# EAGLE design uBus-V1.0 (EAGLE 7.3.0)
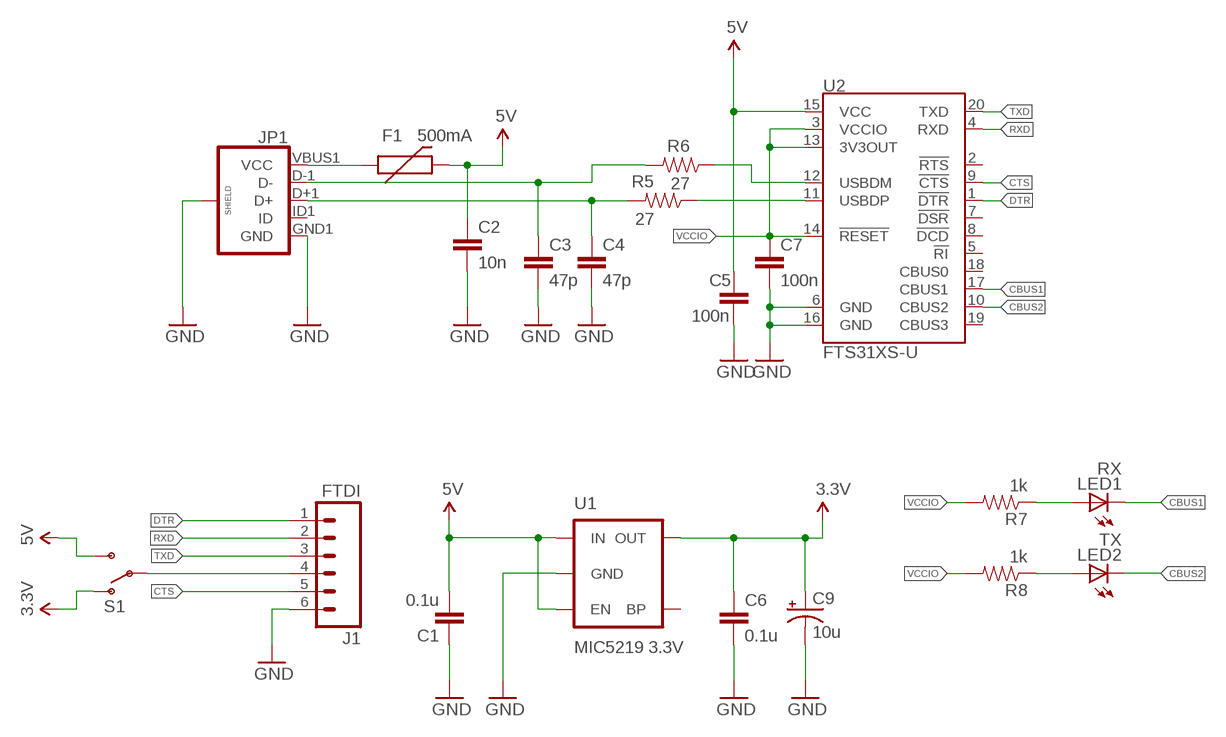
[diagram p0: schematic, sheet 1]

## Parts
C1  0.1u  CAP0603-CAP  [0603-CAP]
C2  10n  CAP0603-CAP  [0603-CAP]
C3  47p  CAP0603-CAP  [0603-CAP]
C4  47p  CAP0603-CAP  [0603-CAP]
C5  100n  CAP0603-CAP  [0603-CAP]
C6  0.1u  CAP0603-CAP  [0603-CAP]
C7  100n  CAP0603-CAP  [0603-CAP]
C9  10u  CPOL-USSMCP  [SMC_P]
F1  500mA  PTCSMD  [PTC-1206]
J1  FTDI  M06LONGPADS  [1X06_LONGPADS]
JP1  USB_MICROB_PLUGCONN-11752  [USB-B-MICRO-SMD_V03]
LED1  RX  LEDCHIP-LED0603  [CHIP-LED0603]
LED2  TX  LEDCHIP-LED0603  [CHIP-LED0603]
R5  27  RESISTOR0603-RES  [0603-RES]
R6  27  RESISTOR0603-RES  [0603-RES]
R7  1k  RESISTOR0603-RES  [0603-RES]
R8  1k  RESISTOR0603-RES  [0603-RES]
S1  SWITCH-SPDT-SMD-A  [SWITCH-SPST-SMD-A]
U1  MIC5219 3.3V  V_REG_MIC52193.3V  [SOT23-5]
U2  FTS31XS-U  FT231XS  [SSOP20_L]

## Nets
3.3V: C6.1 C9.+ S1.1(O) U1.5(OUT)
5V: C1.2 C2.1 C5.1 F1.2 S1.3(S) U1.1(IN) U1.3(EN) U2.15(VCC)
CBUS1: LED1.C U2.17(CBUS1)
CBUS2: LED2.C U2.10(CBUS2)
CTS: J1.5 U2.9(!CTS)
DTR: J1.1 U2.1(!DTR)
GND: C1.1 C2.2 C3.2 C4.2 C5.2 C6.2 C7.2 C9.- J1.6 JP1.GND1(GND) JP1.SHIELD1(SHIELD) JP1.SHIELD2(SHIELD) JP1.SHIELD3(SHIELD) U1.2(GND) U2.6(GND) U2.16(GND)
N$1: J1.4 S1.2(P)
N$3: LED2.A R8.1
N$4: LED1.A R7.1
N$7: R6.1 U2.12(USBDM)
N$8: R5.1 U2.11(USBDP)
N$9: C4.1 JP1.D+1(D+) R5.2
N$10: C3.1 JP1.D-1(D-) R6.2
N$11: F1.1 JP1.VBUS1(VCC)
RXD: J1.2 U2.4(RXD)
TXD: J1.3 U2.20(TXD)
VCCIO: C7.1 R7.2 R8.2 U2.3(VCCIO) U2.13(3V3OUT) U2.14(!RESET)
Unconnected: JP1.ID1(ID) U1.4(BP) U2.2(!RTS) U2.5(!RI) U2.7(!DSR) U2.8(!DCD) U2.18(CBUS0) U2.19(CBUS3)

## Library data of the parts
C1-C7 = SparkFun-Passives:CAP: Capacitor Standard 0603 ceramic capacitor, and 0.1" leaded capacitor.
C9 = rcl:CPOL-US: POLARIZED CAPACITOR, American symbol
F1 = SparkFun-PowerIC:PTC: Resettable Fuse PTC Resettable Fuse. Spark Fun Electronics SKU : COM-08357; PROD_ID: RES-11150
J1 = SparkFun-Connectors:M06: Header 6 Standard 6-pin 0.1" header. Use with straight break away headers (SKU : PRT-00116), right angle break away headers (PRT-00553), swiss pins (PRT-00743), machine pins (PRT-00117), and female headers (PRT-00115). Molex polarized connector foot print use with SKU : PRT-08094 with associated crimp pins and housings. NOTES ON THE VARIANTS LOCK and LOCK_LONGPADS... This footprint was designed to help hold the alignment of a through-hole component (i.e. 6-pin header) while soldering it into place. You may notice that each hole has been shifted either up or down by 0.005 of an inch from it's more standard position (which is a perfectly straight line). This slight alteration caused the pins (the squares in the middle) to touch the edges of the holes. Because they are alternating, it causes a "brace" to hold the component in place. 0.005 has proven to be the perfect amount of "off-center" position when using our standard breakaway headers. Although looks a little odd when you look at the bare footprint, once you have a header in there, the alteration is very hard to notice. Also,if you push a header all the way into place, it is covered up entirely on the bottom side. This idea of altering the position of holes to aid alignment will be further integrated into the Sparkfun Library for other footprints. It can help hold any component with 3 or more connection pins.
JP1 = SparkFun-Connectors:USB_MICROB_PLUG: USB Micro-B connectors Some male, some female. Watch your step!; PROD_ID: CONN-11752
LED1 LED2 = led:LED: LED OSRAM: - CHIPLED LG R971, LG N971, LY N971, LG Q971, LY Q971, LO R971, LY R971 LH N974, LH R974 LS Q976, LO Q976, LY Q976 LO Q996 - Hyper CHIPLED LW Q18S LB Q993, LB Q99A, LB R99A - SideLED LS A670, LO A670, LY A670, LG A670, LP A670 LB A673, LV A673, LT A673, LW A673 LH A674 LY A675 LS A676, LA A676, LO A676, LY A676, LW A676 LS A679, LY A679, LG A679 - Hyper Micro SIDELED® LS Y876, LA Y876, LO Y876, LY Y876 LT Y87S - SmartLED LW L88C, LW L88S LB L89C, LB L89S, LG L890 LS L89K, LO L89K, LY L89K LS L896, LA L896, LO L896, LY L896 - TOPLED LS T670, LO T670, LY T670, LG T670, LP T670 LSG T670, LSP T670, LSY T670, LOP T670, LYG T670 LG T671, LOG T671, LSG T671 LB T673, LV T673, LT T673, LW T673 LH T674 LS T676, LA T676, LO T676, LY T676, LB T676, LH T676, LSB T676, LW T676 LB T67C, LV T67C, LT T67C, LS T67K, LO T67K, LY T67K, LW E67C LS E67B, LA E67B, LO E67B, LY E67B, LB E67C, LV E67C, LT E67C LW T67C LS T679, LY T679, LG T679 LS T770, LO T770, LY T770, LG T770, LP T770 LB T773, LV T773, LT T773, LW T773 LH T774 LS E675, LA E675, LY E675, LS T675 LS T776, LA T776, LO T776, LY T776, LB T776 LHGB T686 LT T68C, LB T68C - Hyper Mini TOPLED® LB M676 - Mini TOPLED Santana® LG M470 LS M47K, LO M47K, LY M47K Source: http://www.osram.convergy.de LUXEON: - LUMILED® LXK2-PW12-R00, LXK2-PW12-S00, LXK2-PW14-U00, LXK2-PW14-V00 LXK2-PM12-R00, LXK2-PM12-S00, LXK2-PM14-U00 LXK2-PE12-Q00, LXK2-PE12-R00, LXK2-PE12-S00, LXK2-PE14-T00, LXK2-PE14-U00 LXK2-PB12-K00, LXK2-PB12-L00, LXK2-PB12-M00, LXK2-PB14-N00, LXK2-PB14-P00, LXK2-PB14-Q00 LXK2-PR12-L00, LXK2-PR12-M00, LXK2-PR14-Q00, LXK2-PR14-R00 LXK2-PD12-Q00, LXK2-PD12-R00, LXK2-PD12-S00 LXK2-PH12-R00, LXK2-PH12-S00 LXK2-PL12-P00, LXK2-PL12-Q00, LXK2-PL12-R00 Source: www.luxeon.com KINGBRIGHT: KA-3528ASYC Source: www.kingbright.com
R5-R8 = SparkFun-Passives:RESISTOR: Resistor Basic schematic elements and footprints for 0603, 1206, and PTH resistors.
S1 = SparkFun-Electromechanical:SWITCH-SPDT: SPDT Switch Simple slide switch, Spark Fun Electronics SKU : COM-00102 DPDT SMT slide switch, AYZ0202, SWCH-08179
U1 = SparkFun-PowerIC:V_REG_MIC5219: V_REG MIC5219 Standard 3.3V and 5V 500mA LDO voltage regulator in SOT-23 layout. Micrel part MIC5219. BP (by-pass) pin is used to lower output noise with 470pF cap, may be left open.; PROD_ID: VREG-09872
U2 = SparkFun-DigitalIC:FT231X: FTDI FT231X Full Speed USB to Full-handshake UART This USB2.0 Full Speed IC offers a compact bridge to full handshake UART interfaces. The device is a UART, capable of operating up to 3MBaud, with low power consumption (8mA). The FT231X includes the complete FT-X series feature set and enables USB to be added into a system design quickly and easily over a UART interface.; PROD_ID: IC-11524

## Board
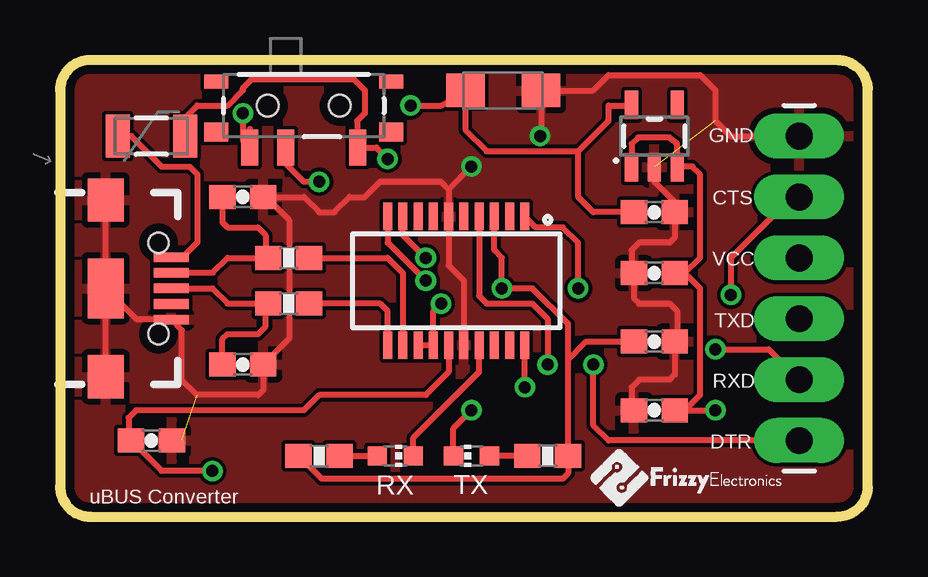
[diagram p1: board, top side]
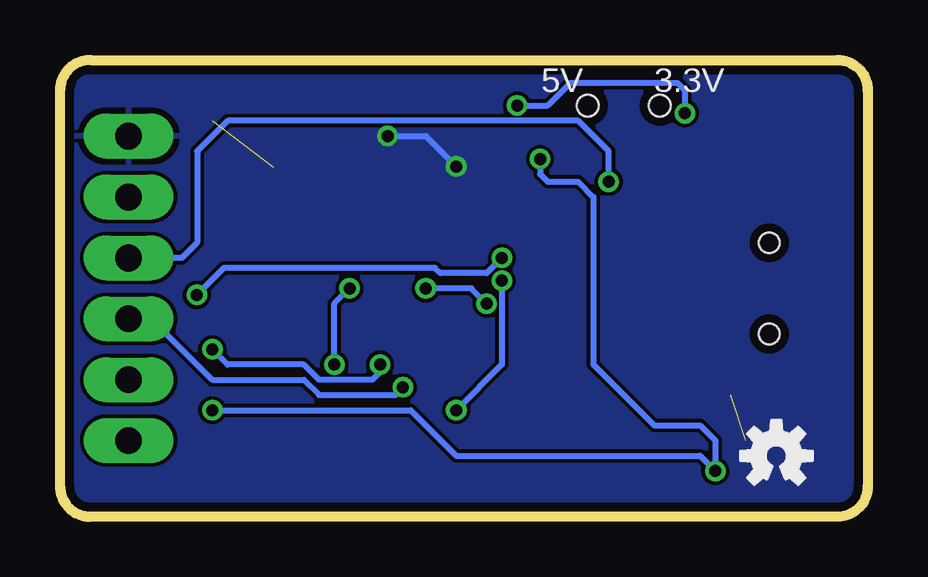
[diagram p2: board, bottom side, seen from below]

Size 33.66 x 19.05 mm. Coordinates in mm from the lower left corner, seen from the top.
Outline: 0,17.78 0,1.27 arc90 1.27,0 32.38,0 arc90 33.66,1.27 33.66,17.78 arc90 32.38,19.05 1.27,19.05 arc90 0,17.78
Copper layers (1*16): Top 0.0356mm / dielectric 1.5011mm / Bottom 0.0356mm
Design rules "oshpark-2layer": minimum track width 6mil, minimum drill 13mil, track to track 6mil, track to pad 6mil, pad to pad 6mil, via to via 6mil, smd to smd 6mil, copper to edge 15mil, drill to drill 6mil, minimum pad ring 7mil, minimum via ring 7mil, stop-mask expansion 2.5mil, vias tented up to drill 0mil, thermal gap 10mil

### Footprints (pad centres in the part's own frame; a part is rotated, then mirrored left to right if it is on the bottom)
0603-CAP = smd 1.1 x 1: 1 -0.85,0; 2 0.85,0
SMC_P = smd 1.6 x 1.4: + -1.575,0; - 1.575,0
PTC-1206 = smd 1 x 1.8: 1 -1.4,0; 2 1.4,0
1X06_LONGPADS = drill 1.118 pad 1.88 long: 1 0,0; 2 2.54,0; 3 5.08,0; 4 7.62,0; 5 10.16,0; 6 12.7,0
USB-B-MICRO-SMD_V03 = smd 1.45 x 0.4: D+1 2.725,0; D-1 2.725,0.65; GND1 2.725,-1.3; ID1 2.725,-0.65; VBUS1 2.725,1.3 | smd 1.5 x 1.8: SHIELD1 0,3.685; SHIELD2 0,-3.685 | smd 1.5 x 2.5: SHIELD3 0,0 | hole 0.85: 2.2,1.9; 2.2,-1.9
CHIP-LED0603 = smd 0.8 x 0.8: A 0,-0.75; C 0,0.75
0603-RES = smd 1.1 x 1: 1 -0.85,0; 2 0.85,0
SWITCH-SPST-SMD-A = smd 0.7 x 1.5: 1 -2.25,-1.75; 2 -0.75,-1.75; 3 2.25,-1.75 | smd 1 x 0.6: GND1 -3.65,1; GND3 3.65,1 | smd 1 x 0.8: GND2 -3.65,-1.1; GND4 3.65,-1.1 | hole 0.9: -1.5,0; 1.5,0
SOT23-5 = smd 0.55 x 1.2: 1 -0.95,-1.3; 2 0,-1.3; 3 0.95,-1.3; 4 0.95,1.3; 5 -0.95,1.3
SSOP20_L = smd 0.381 x 1.143: 1 -2.857,-2.68; 2 -2.223,-2.68; 3 -1.587,-2.68; 4 -0.953,-2.68; 5 -0.318,-2.68; 6 0.318,-2.68; 7 0.953,-2.68; 8 1.587,-2.68; 9 2.223,-2.68; 10 2.857,-2.68; 11 2.857,2.68; 12 2.223,2.68; 13 1.587,2.68; 14 0.953,2.68; 15 0.318,2.68; 16 -0.318,2.68; 17 -0.953,2.68; 18 -1.587,2.68; 19 -2.223,2.68; 20 -2.857,2.68

### Placement (x,y rotation side)
C1  24.77,10.16 0 top
C2  3.81,3.18 0 top
C3  7.62,13.34 0 top
C4  7.62,6.35 0 top
C5  24.77,4.45 180 top
C6  24.77,12.7 0 top
C7  24.77,7.3 0 top
C9  18.47,17.77 0 top
F1  3.81,15.88 0 top
J1  30.8,3.18 90 top
JP1  1.9,9.52 0 top
LED1  13.97,2.54 270 top
LED2  17.15,2.54 90 top
R5  9.53,8.89 180 top
R6  9.53,10.8 180 top
R7  10.79,2.54 180 top
R8  20.32,2.54 0 top
S1  10.16,17.15 0 top
U1  24.77,15.88 0 top
U2  16.51,9.84 180 top
U$1  [OSHW-LOGO-S]  3.81,2.54 0 bottom

### Tracks (layer width: path | path; a pad name or v marks a point on that pad's centre or on a via)
3.3V  (via drill 0.5)
  Top 0.254: 7.91,16.16 S1.1 7.62,15.68 v7.62,16.83 | v14.6,17.15 15.89,17.15 C9.+ 16.89,16.13 17.78,15.24 21.59,15.24 | 21.59,15.24 22.86,16.51 22.86,17.15 23.79,17.15 U1.5 | C6.1 22.23,12.7 21.59,13.34 21.59,15.24
  Bottom 0.254: v14.6,17.15 13.33,17.15 12.38,18.1 7.94,18.1 7.62,17.78 v7.62,16.83
5V  (via drill 0.5)
  Top 0.254: F1.2 5.21,16.64 5.71,17.15 6.99,17.15 7.62,17.78 7.62,17.88 7.99,18.25 12.23,18.25 12.7,17.78 12.7,16.83 12.38,16.51 12.38,15.42 S1.3 13.18,15.39 v13.65,14.92 | U2.15 16.19,6.03 15.24,5.08 10.79,5.08 10.16,4.45 3.17,4.45 2.86,4.13 2.86,3.28 C2.1 4.23,1.91 v6.35,1.91 | 26.04,10.16 26.67,9.52 26.67,5.08 26.04,4.45 C5.1 v27.3,4.45 | C1.2 26.04,10.16 | 26.04,10.16 26.67,10.8 26.67,14.29 26.35,14.61 25.75,14.61 U1.3 25.72,15.56 25.39,15.81 24.09,15.81 23.81,15.56 U1.1
  Bottom 0.254: v13.65,14.92 13.65,14.29 13.33,13.97 12.06,13.97 11.43,13.34 11.43,6.35 8.89,3.81 6.99,3.81 6.35,3.18 v6.35,1.91 6.99,2.54 17.15,2.54 19.05,4.45 v27.3,4.45
CBUS1
  Top 0.254: LED1.C 14.72,3.29 17.46,6.03 U2.17
CBUS2  (via drill 0.5)
  Top 0.254: LED2.C 16.4,3.7 v17.15,4.45 | U2.10 13.65,11.43 v15.24,9.84
  Bottom 0.254: v15.24,9.84 15.24,6.35 v17.15,4.45
CTS  (via drill 0.5)
  Top 0.254: J1.5 30.48,13.34 27.94,10.8 v27.96,9.25 | v15.24,10.8 14.29,11.75 U2.9
  Bottom 0.254: v15.24,10.8 15.87,10.16 17.81,10.16 18.03,10.38 26.83,10.38 v27.96,9.25
DTR  (via drill 0.5)
  Top 0.254: J1.1 22.86,3.18 22.23,3.81 v22.23,6.35 | v21.59,9.52 21.59,11.43 20.95,12.07 19.83,12.07 U2.1
  Bottom 0.254: v22.23,6.35 22.23,8.89 v21.59,9.52
GND  (via drill 0.5)  (2 unrouted)
  Top 0.254: JP1.SHIELD3 3.17,8.25 4.6,8.25 JP1.GND1 5.08,7.77 5.08,5.71 5.71,5.08 8.26,5.08 8.47,5.3 C4.2 9.55,7.43 9.55,12.38 8.59,13.34 C3.2 10.16,13.34 10.79,12.7 11.43,12.7 12.06,13.34 12.7,13.34 13.33,13.97 15.87,13.97 16.19,13.65 | C2.2 5.08,3.18 | 16.19,13.65 U2.6 16.19,10.48 16.83,9.84 U2.16 | JP1.SHIELD3 JP1.SHIELD1 | JP1.SHIELD2 JP1.SHIELD3 | C5.2 23.81,4.55 23.81,5.4 24.13,5.71 25.4,5.71 25.62,5.93 C7.2 25.72,7.41 25.72,8.57 25.4,8.89 24.13,8.89 23.91,9.11 C1.1 23.81,10.26 23.81,11.11 24.13,11.43 25.4,11.43 25.62,11.64 C6.2 25.62,13.12 24.77,13.97 U1.2 | J1.6 27.94,15.88 27.3,16.51 27.3,17.78 26.67,18.41 22.86,18.41 22.22,17.77 C9.- 20.04,15.91 v20,15.88 | v17.15,14.61 16.19,13.65
  Bottom 0.254: v20,15.88 18.41,15.88 v17.15,14.61
  pour Top: 1.27,19.05 32.38,19.05 arc-90 33.66,17.78 33.66,1.27 arc-90 32.38,0 1.27,0 arc-90 0,1.27 0,17.78 arc-90
  pour Bottom: 1.27,19.05 32.38,19.05 arc-90 33.66,17.78 33.66,1.27 arc-90 32.38,0 1.27,0 arc-90 0,1.27 0,17.78 arc-90
N$1  (via drill 0.5)
  Top 0.254: S1.2 9.41,14.72 10.16,13.97 v10.79,13.97
  Bottom 0.254: v10.79,13.97 10.79,15.24 12.06,16.51 26.67,16.51 27.94,15.24 27.94,11.43 28.58,10.8 J1.4
N$3
  Top 0.254: R8.1 LED2.A
N$4
  Top 0.254: R7.1 LED1.A
N$7
  Top 0.254: R6.1 13.65,10.8 14.29,10.16 U2.12
N$8
  Top 0.254: U2.11 13.65,8.57 13.33,8.89 R5.1
N$9
  Top 0.254: JP1.D+1 6.35,9.52 6.99,8.89 R5.2 8.57,8.79 8.57,7.94 8.26,7.62 6.99,7.62 6.77,7.41 C4.1
N$10
  Top 0.254: JP1.D-1 6.37,10.18 6.99,10.8 R6.2 8.57,10.9 8.57,11.75 8.26,12.07 6.99,12.07 6.77,12.28 C3.1
N$11
  Top 0.254: JP1.VBUS1 5.11,10.82 5.73,11.44 5.73,14.28 5.41,14.6 4.25,14.6 2.97,15.88 F1.1
RXD  (via drill 0.5)
  Top 0.254: U2.4 17.46,9.21 17.78,8.89 19.69,8.89 20.32,8.25 v20.32,6.35 | v27.3,6.98 29.53,6.98 J1.2
  Bottom 0.254: v20.32,6.35 20.32,6.03 20.64,5.71 22.86,5.71 23.5,6.35 26.67,6.35 v27.3,6.98
TXD  (via drill 0.5)
  Top 0.254: v19.37,5.4 U2.20
  Bottom 0.254: J1.3 29.84,8.25 27.3,5.71 23.5,5.71 22.86,5.08 19.69,5.08 v19.37,5.4
VCCIO  (via drill 0.5)
  Top 0.254: R7.2 10.9,1.59 20.95,1.59 21.17,1.8 R8.2 21.17,6.57 | 21.17,6.57 21.91,7.3 C7.1 | U2.13 U2.14 15.56,8.57 v15.87,8.89 | U2.3 18.1,11.11 18.41,10.8 v18.41,9.52 19.69,9.52 21.17,8.04 21.17,6.57
  Bottom 0.254: v15.87,8.89 16.51,9.52 v18.41,9.52

### Text on the board
tNames: GND | CTS | VCC | TXD | RXD | DTR | RX | TX | uBUS Converter
bNames: 3.3V | 5V